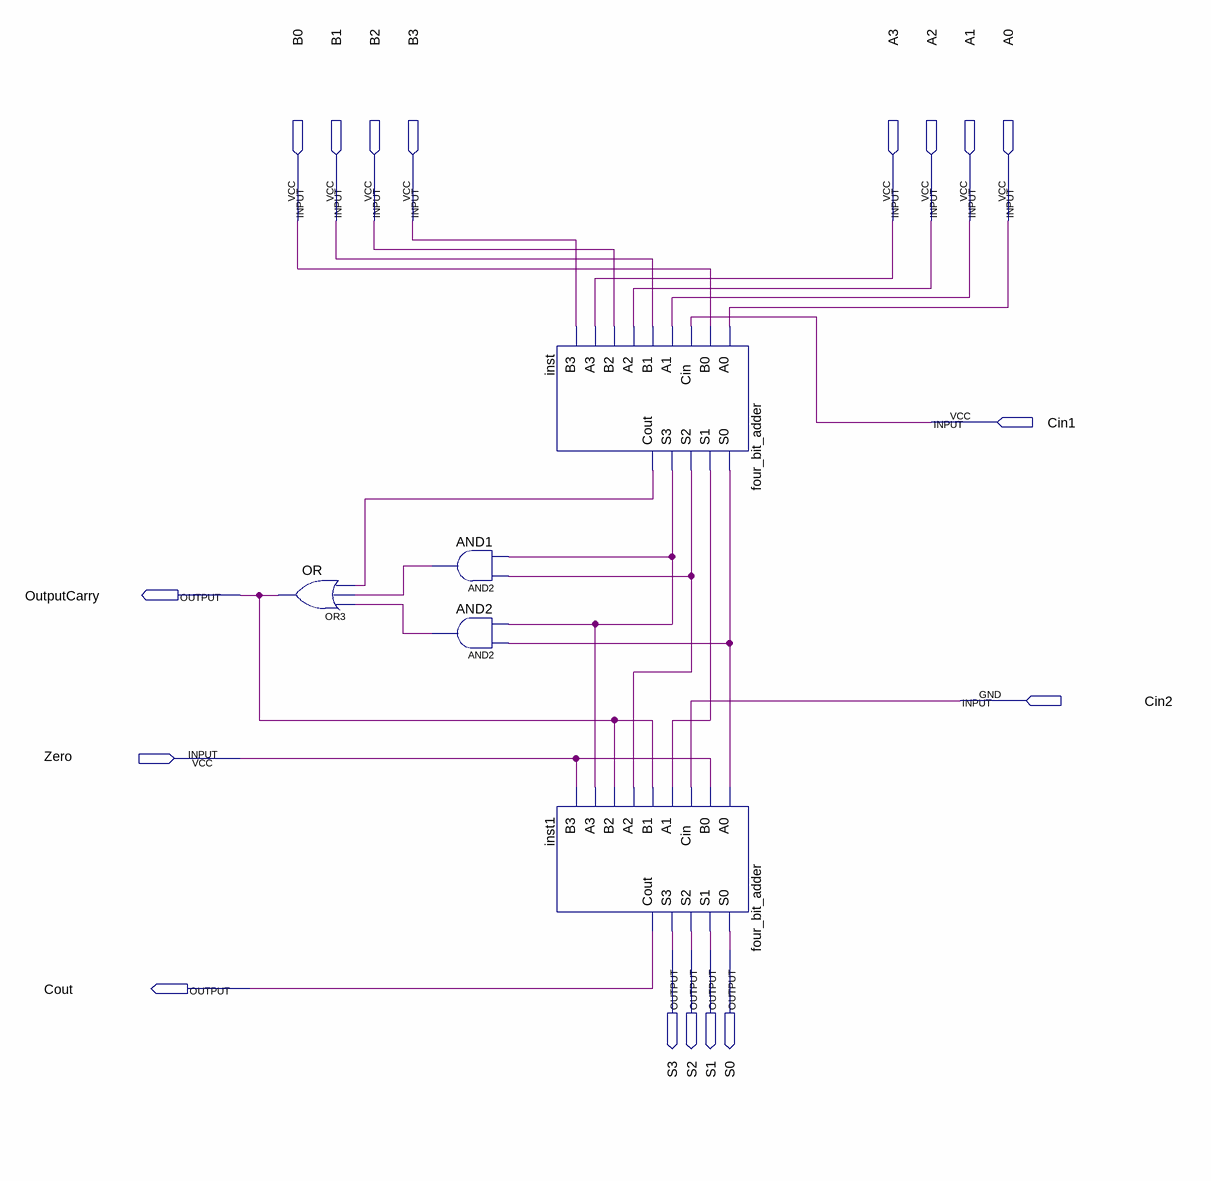
[diagram p0: schematic sheet]
// Quartus schematic four_bit_bcd_adder.bdf as structural Verilog: 5 symbols, 17 pins
module four_bit_bcd_adder (
  input  B0,
  input  B1,
  input  B2,
  input  B3,
  input  A3,
  input  A2,
  input  A1,
  input  A0,
  input  Cin1,
  input  Cin2,
  input  Zero,
  output OutputCarry,
  output S3,
  output S2,
  output S1,
  output S0,
  output Cout
);

  wire AND1_out, AND2_out, inst_cout, inst_s0, inst_s1, inst_s2, inst_s3;

  or OR (OutputCarry, AND2_out, AND1_out, inst_cout);
  and AND1 (AND1_out, inst_s2, inst_s3);
  and AND2 (AND2_out, inst_s0, inst_s3);
  four_bit_adder inst (
    .A0(A0), .B0(B0), .Cin(Cin1), .A1(A1), .B1(B1), .A2(A2), .B2(B2), .A3(A3), .B3(B3), .S0(inst_s0),
    .S1(inst_s1), .S2(inst_s2), .S3(inst_s3), .Cout(inst_cout));
  four_bit_adder inst1 (
    .A0(inst_s0), .B0(Zero), .Cin(Cin2), .A1(inst_s1), .B1(OutputCarry), .A2(inst_s2), .B2(OutputCarry),
    .A3(inst_s3), .B3(Zero), .S0(S0), .S1(S1), .S2(S2), .S3(S3), .Cout(Cout));
endmodule
